# Altium schematic sheet top.SchDoc
size A4
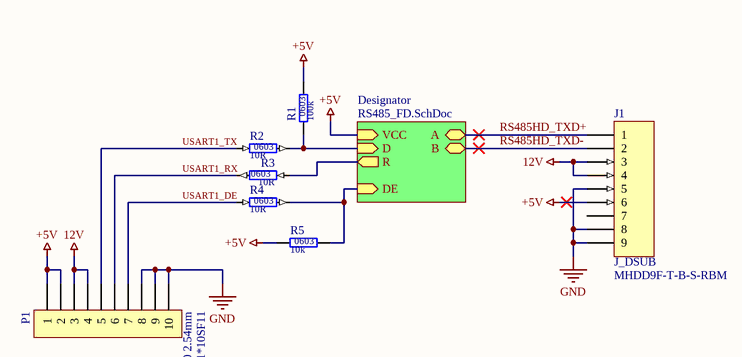
[diagram p0: top.SchDoc]

## Parts
J1  value MHDD9F-T-B-S-RBM  [J_DSUB_MHDD9F-T-B-S-RBM]  (hidden comment: DSUB 9 Pin)
P1  value DS1021-1*10SF11  SCH_Footprint: 1x10 2.54mm  [P_HEADER_1x10_2.54]  (hidden comment: Goldpin)
R1  value 100k  SCH_Footprint: 0603  [R_0603_1608]  (hidden comment: Resistor)
R2  value 10R  SCH_Footprint: 0603  [R_0603_1608]  (hidden comment: Resistor)
R3  value 10R  SCH_Footprint: 0603  [R_0603_1608]  (hidden comment: Resistor)
R4  value 10R  SCH_Footprint: 0603  [R_0603_1608]  (hidden comment: Resistor)
R5  value 10k  SCH_Footprint: 0603  [R_0603_1608]  (hidden comment: Resistor)

## Sub-sheets
Designator = RS485_FD.SchDoc: VCC (in), R (out), D (in), DE (in), A (bidir), B (bidir)

## Nets
12V: J1.3 J1.4 P1.3 P1.4
+5V: J1.6 P1.1 P1.2 R1.2 R5.1 ; sheet Designator/VCC
GND: J1.5 J1.8 J1.9 P1.8 P1.9 P1.10
RS485HD_TXD+: J1.1 ; sheet Designator/A
RS485HD_TXD-: J1.2 ; sheet Designator/B
USART1_DE: P1.7 R4.1
USART1_RX: P1.6 R3.2
USART1_TX: P1.5 R2.1
NetR1_1: R1.1 R2.2 ; sheet Designator/D
NetR3_1: R3.1 ; sheet Designator/R
NetR4_2: R4.2 R5.2 ; sheet Designator/DE

Not connected (* = marked no-connect by the designer): J1 0(NC) 7

## Library data of the parts
J1 = J_DSUB: Header, 9-Pin; SCH_Footprint: J_DSUB; Part Number: J_DSUB; Component Type: Standard; HelpURL: https://www.tme.eu/Document/d24efe21bdaa08410b5ca50a678e1de1/MHDDXX-F-T-B-S-RBM.PDF; Manufacturer: -; Manufacturer Part Number: MHDD9F-T-B-S-RBM; Supplier 1: TME; Supplier Part Number 1: MHDD9F-T-B-S-RBM; Supplier 2: RS Components; Supplier 3: Farnell; Supplier Part Number 3: 2533067; Supplier 4: Mouser; Supplier 5: Digi-Key
P1 = P_HEADER_1x10_2.54: Pin Header; Manufacturer: Connfly; Part Number: P_HEADER_1x10_2.54; Component Type: Standard; HelpURL: http://www.tme.eu/en/Document/cc301e58a5da78cb543a94b5a5b7f06a/DS1021.pdf; Manufacturer Part Number: DS1021-1*10SF11; Supplier 1: TME; Supplier Part Number 1: ZL201-10G; Supplier 2: RS Components; Supplier 3: Farnell; Supplier 4: Mouser; Supplier 5: Digi-Key
R1 = R_100k_0603_1: Manufacturer: Royalohm; Manufacturer Part Number: 0603SAF1003T5E; Voltage: 50V; Power: 100mW; Tolerance: 1%; Part Number: R_100k_0603_1; HelpURL: http://www.tme.eu/pl/Document/b315665a56acbc42df513c99b390ad98/ROYALOHM-THICKFILM.pdf; Supplier 1: TME; Supplier Part Number 1: SMD0603-100K-1%; Supplier 2: RS Components; Supplier 3: Farnell; Supplier 4: Mouser; Supplier Part Number 4: 667-ERJ-3EKF1003V; Supplier 5: Digi-Key; Supplier Part Number 5: P100KHCT-ND
R2-R4 = R_10R_0603_1: Manufacturer: Royalohm; Manufacturer Part Number: 0603SAF100JT5E; Voltage: 50V; Power: 100mW; Tolerance: 1%; Part Number: R_10R_0603_1; HelpURL: http://www.tme.eu/pl/Document/b315665a56acbc42df513c99b390ad98/ROYALOHM-THICKFILM.pdf; Supplier 1: TME; Supplier Part Number 1: SMD0603-10R-1%; Supplier 2: RS Components; Supplier 3: Farnell; Supplier 4: Mouser; Supplier 5: Digi-Key
R5 = R_10k_0603_1: Manufacturer: Vishay; Manufacturer Part Number: CRCW060310K0FKTABC; Voltage: 75V; Power: 100mW; Tolerance: 1%; Part Number: R_10k_0603_1; HelpURL: http://www.tme.eu/pl/Document/622e28308c06d160637f2b14751ba16b/Data%20Sheet%20CRCW_BCe3.pdf; Supplier 1: TME; Supplier Part Number 1: CRCW060310K0FKTABC; Supplier 2: RS Components; Supplier 3: Farnell; Supplier 4: Mouser; Supplier Part Number 4: 667-ERJ-3EKF1002V; Supplier 5: Digi-Key; Supplier Part Number 5: P10KGCT-ND